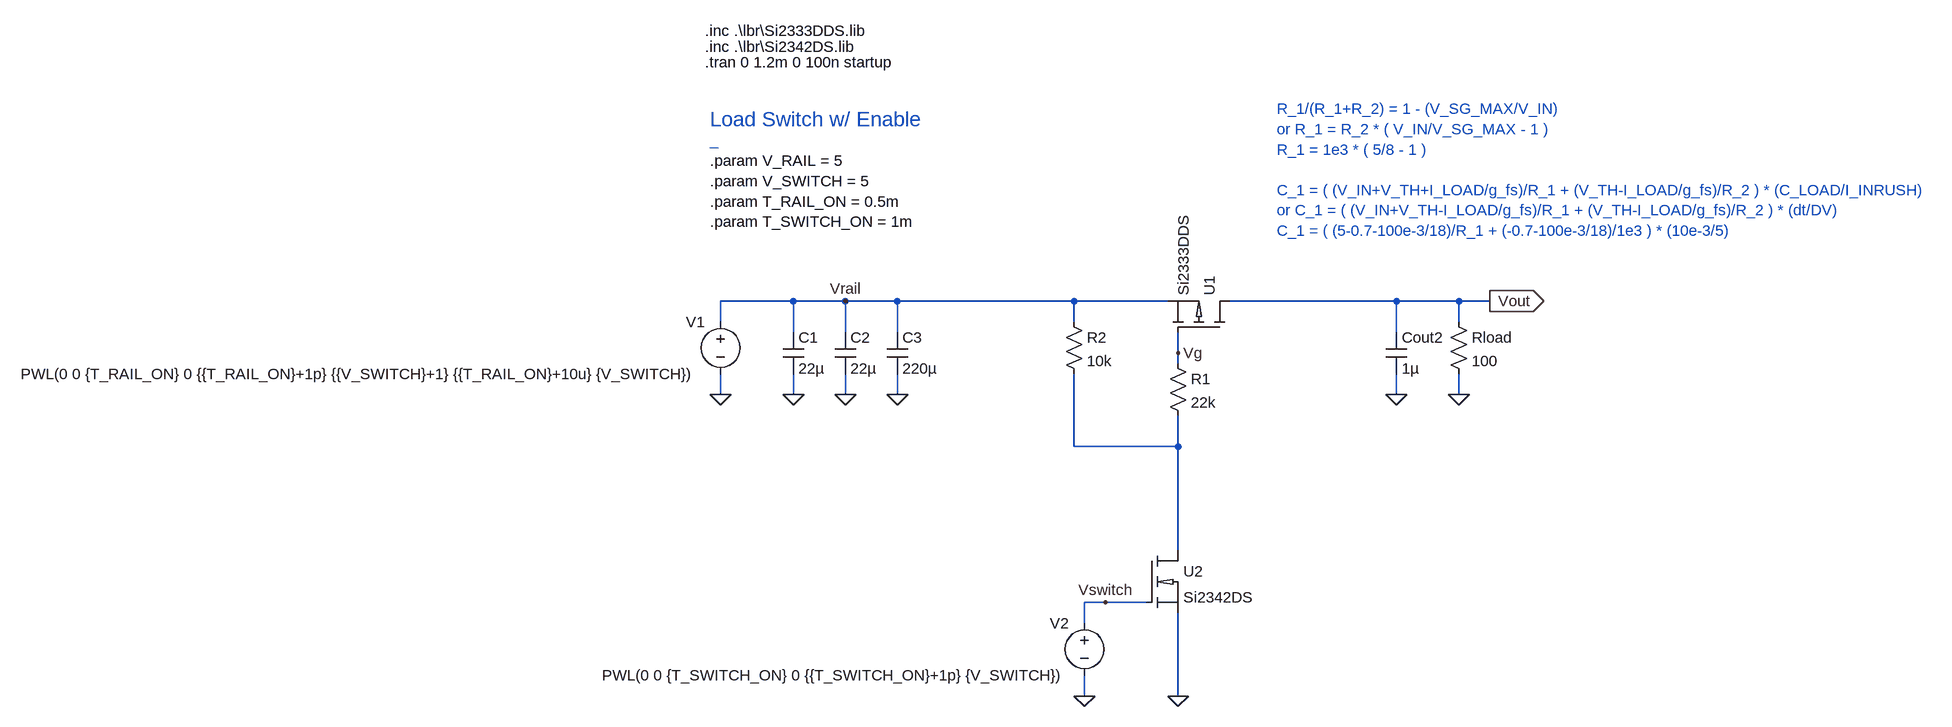
[diagram p0: schematic load_switch_w_enable.asc]
load_switch_w_enable.asc, the LTspice schematic file:
Version 4
SHEET 1 1920 680
WIRE -624 -80 -736 -80
WIRE -544 -80 -624 -80
WIRE -464 -80 -544 -80
WIRE -192 -80 -464 -80
WIRE -48 -80 -192 -80
WIRE 304 -80 48 -80
WIRE 400 -80 304 -80
WIRE 448 -80 400 -80
WIRE -736 -48 -736 -80
WIRE -192 -48 -192 -80
WIRE 400 -48 400 -80
WIRE -624 -32 -624 -80
WIRE -544 -32 -544 -80
WIRE -464 -32 -464 -80
WIRE 304 -32 304 -80
WIRE -32 0 -32 -32
WIRE -32 16 -32 0
WIRE -736 64 -736 32
WIRE -624 64 -624 32
WIRE -544 64 -544 32
WIRE -464 64 -464 32
WIRE 304 64 304 32
WIRE 400 64 400 32
WIRE -192 144 -192 32
WIRE -32 144 -32 96
WIRE -32 144 -192 144
WIRE -32 304 -32 144
WIRE -144 384 -176 384
WIRE -80 384 -144 384
WIRE -176 416 -176 384
WIRE -176 528 -176 496
WIRE -32 528 -32 400
FLAG 448 -80 Vout
IOPIN 448 -80 Out
FLAG -176 528 0
FLAG 400 64 0
FLAG -624 64 0
FLAG -544 64 0
FLAG -464 64 0
FLAG 304 64 0
FLAG -736 64 0
FLAG -32 528 0
FLAG -544 -80 Vrail
FLAG -144 384 Vswitch
FLAG -32 0 Vg
SYMBOL voltage -176 400 M0
WINDOW 123 0 0 Left 2
WINDOW 39 0 0 Left 2
SYMATTR InstName V2
SYMATTR Value PWL(0 0 {T_SWITCH_ON} 0 {{T_SWITCH_ON}+1p} {V_SWITCH})
SYMBOL res 384 -64 R0
SYMATTR InstName Rload
SYMATTR Value 100
SYMBOL cap -640 -32 R0
SYMATTR InstName C1
SYMATTR Value 22µ
SYMBOL cap -560 -32 R0
SYMATTR InstName C2
SYMATTR Value 22µ
SYMBOL cap -480 -32 R0
SYMATTR InstName C3
SYMATTR Value 220µ
SYMBOL cap 288 -32 R0
SYMATTR InstName Cout2
SYMATTR Value 1µ
SYMBOL voltage -736 -64 M0
WINDOW 123 0 0 Left 2
WINDOW 39 0 0 Left 2
SYMATTR InstName V1
SYMATTR Value PWL(0 0 {T_RAIL_ON} 0 {{T_RAIL_ON}+1p} {{V_SWITCH}+1} {{T_RAIL_ON}+10u} {V_SWITCH})
SYMBOL Si2342DS -80 304 R0
SYMATTR InstName U2
SYMBOL Si2333DDS 48 -32 M270
SYMATTR InstName U1
SYMBOL res -208 -64 R0
SYMATTR InstName R2
SYMATTR Value 10k
SYMBOL res -48 0 R0
SYMATTR InstName R1
SYMATTR Value 22k
TEXT -760 -472 Left 2 !.inc .\\lbr\\Si2342DS.lib
TEXT -760 -448 Left 2 !.tran 0 1.2m 0 100n startup
TEXT -752 -360 Left 3 ;Load Switch w/ Enable
TEXT -752 -296 Left 2 !.param V_RAIL = 5\n.param V_SWITCH = 5\n.param T_RAIL_ON = 0.5m\n.param T_SWITCH_ON = 1m
TEXT -752 -328 Left 2 ;_
TEXT 120 -376 Left 2 ;R_1/(R_1+R_2) = 1 - (V_SG_MAX/V_IN)\nor R_1 = R_2 * ( V_IN/V_SG_MAX - 1 )\nR_1 = 1e3 * ( 5/8 - 1 )\n \nC_1 = ( (V_IN+V_TH+I_LOAD/g_fs)/R_1 + (V_TH-I_LOAD/g_fs)/R_2 ) * (C_LOAD/I_INRUSH)\nor C_1 = ( (V_IN+V_TH-I_LOAD/g_fs)/R_1 + (V_TH-I_LOAD/g_fs)/R_2 ) * (dt/DV)\nC_1 = ( (5-0.7-100e-3/18)/R_1 + (-0.7-100e-3/18)/1e3 ) * (10e-3/5)
TEXT -760 -496 Left 2 !.inc .\\lbr\\Si2333DDS.lib

The netlist it stands for:
* load_switch_w_enable.asc
V2 Vswitch 0 PWL(0 0 {T_SWITCH_ON} 0 {{T_SWITCH_ON}+1p} {V_SWITCH})
Rload Vout 0 100
C1 Vrail 0 22µ
C2 Vrail 0 22µ
C3 Vrail 0 220µ
Cout2 Vout 0 1µ
V1 Vrail 0 PWL(0 0 {T_RAIL_ON} 0 {{T_RAIL_ON}+1p} {{V_SWITCH}+1} {{T_RAIL_ON}+10u} {V_SWITCH})
XU2 N001 Vswitch 0 Si2342DS  ; pins D G S
XU1 Vout Vg Vrail Si2333DDS  ; pins D G S
R2 Vrail N001 10k
R1 Vg N001 22k
.inc .\lbr\Si2342DS.lib
.tran 0 1.2m 0 100n startup
* Load Switch w/ Enable
.param V_RAIL = 5
.param V_SWITCH = 5
.param T_RAIL_ON = 0.5m
.param T_SWITCH_ON = 1m
* _
* R_1/(R_1+R_2) = 1 - (V_SG_MAX/V_IN)
* or R_1 = R_2 * ( V_IN/V_SG_MAX - 1 )
* R_1 = 1e3 * ( 5/8 - 1 )
* C_1 = ( (V_IN+V_TH+I_LOAD/g_fs)/R_1 + (V_TH-I_LOAD/g_fs)/R_2 ) * (C_LOAD/I_INRUSH)
* or C_1 = ( (V_IN+V_TH-I_LOAD/g_fs)/R_1 + (V_TH-I_LOAD/g_fs)/R_2 ) * (dt/DV)
* C_1 = ( (5-0.7-100e-3/18)/R_1 + (-0.7-100e-3/18)/1e3 ) * (10e-3/5)
.inc .\lbr\Si2333DDS.lib
.backanno
.end